# EAGLE schematic matrix (EAGLE 8.4.0)
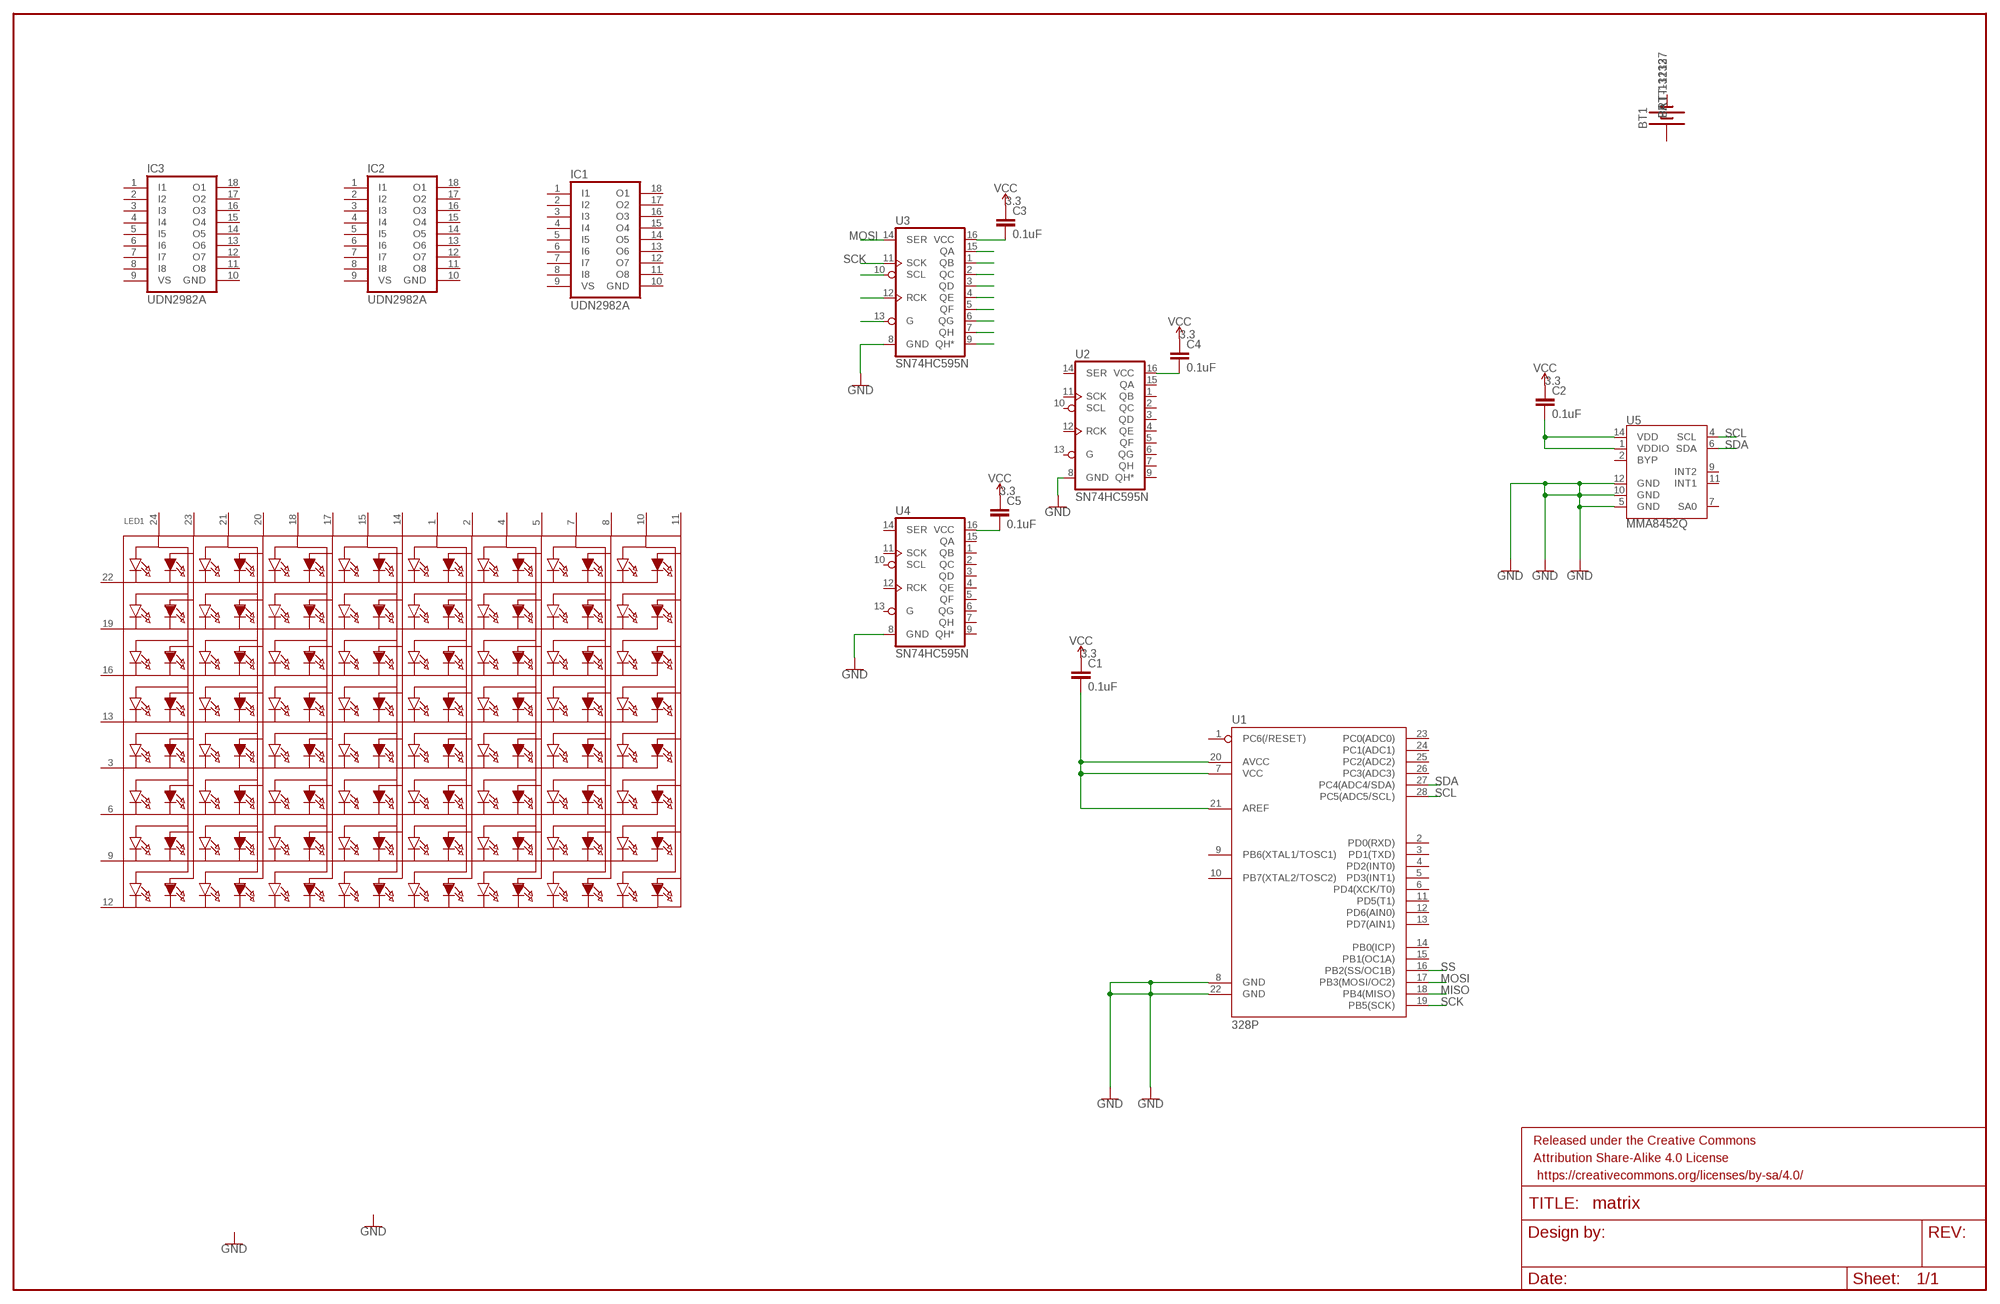
[diagram p0: schematic, sheet 1]

## Parts
BT1  BATTERY-18650  [BATTERY_18650-HOLDER]
C1  0.1uF  0.1UF-0402-16V-10%  [0402]
C2  0.1uF  0.1UF-0402-16V-10%  [0402]
C3  0.1uF  0.1UF-0402-16V-10%  [0402]
C4  0.1uF  0.1UF-0402-16V-10%  [0402]
C5  0.1uF  0.1UF-0402-16V-10%  [0402]
FRAME1  FRAME-LEDGER  [CREATIVE_COMMONS]
IC1  UDN2982A  [DIL18]
IC2  UDN2982A  [DIL18]
IC3  UDN2982A  [DIL18]
LED1  SEGMENT_8X8_BICOLOR_ROWCATHODEMI2A883XX  [SEGMENT_BICOL_BL-M12A883XX]
U1  328P  ATMEGA328P_PDIP  [DIP28]
U2  SN74HC595N  74HC595N  [DIP16]
U3  SN74HC595N  74HC595N  [DIP16]
U4  SN74HC595N  74HC595N  [DIP16]
U5  MMA8452Q  [QFN-16]

## Nets
GND: U1.8(GND) U1.22(GND) U2.8(GND) U3.8(GND) U4.8(GND) U5.5(GND) U5.10(GND) U5.12(GND)
MISO: U1.18(PB4(MISO))
MOSI: U1.17(PB3(MOSI/OC2)) U3.14(SER)
N$1: C2.2 U5.1(VDDIO) U5.14(VDD)
N$2: C1.2 U1.7(VCC) U1.20(AVCC) U1.21(AREF)
N$3: C3.2 U3.16(VCC)
N$5: U3.9(QH*)
N$6: C4.2 U2.16(VCC)
N$7: C5.2 U4.16(VCC)
SCK: U1.19(PB5(SCK))
SCL: U1.28(PC5(ADC5/SCL)) U5.4(SCL)
SDA: U1.27(PC4(ADC4/SDA)) U5.6(SDA)
SS: U1.16(PB2(SS/OC1B))
VCC: C1.1 C2.1 C3.1 C4.1 C5.1
Unconnected: IC1.1(I1) IC1.2(I2) IC1.3(I3) IC1.4(I4) IC1.5(I5) IC1.6(I6) IC1.7(I7) IC1.8(I8) IC1.9(VS) IC1.11(O8) IC1.12(O7) IC1.13(O6) IC1.14(O5) IC1.15(O4) IC1.16(O3) IC1.17(O2) IC1.18(O1) IC2.1(I1) IC2.2(I2) IC2.3(I3) IC2.4(I4) IC2.5(I5) IC2.6(I6) IC2.7(I7) IC2.8(I8) IC2.9(VS) IC2.11(O8) IC2.12(O7) IC2.13(O6) IC2.14(O5) IC2.15(O4) IC2.16(O3) IC2.17(O2) IC2.18(O1) IC3.1(I1) IC3.2(I2) IC3.3(I3) IC3.4(I4) IC3.5(I5) IC3.6(I6) IC3.7(I7) IC3.8(I8) IC3.9(VS) IC3.11(O8) IC3.12(O7) IC3.13(O6) IC3.14(O5) IC3.15(O4) IC3.16(O3) IC3.17(O2) IC3.18(O1) LED1.1(A9) LED1.2(A10) LED1.3(K5) LED1.4(A11) LED1.5(A12) LED1.6(K6) LED1.7(A13) LED1.8(A14) LED1.9(K7) LED1.10(A15) LED1.11(A16) LED1.12(K8) LED1.13(K4) LED1.14(A8) LED1.15(A7) LED1.16(K3) LED1.17(A6) LED1.18(A5) LED1.19(K2) LED1.20(A4) LED1.21(A3) LED1.22(K1) LED1.23(A2) LED1.24(A1) U1.1(PC6(/RESET)) U1.2(PD0(RXD)) U1.3(PD1(TXD)) U1.4(PD2(INT0)) U1.5(PD3(INT1)) U1.6(PD4(XCK/T0)) U1.9(PB6(XTAL1/TOSC1)) U1.10(PB7(XTAL2/TOSC2)) U1.11(PD5(T1)) U1.12(PD6(AIN0)) U1.13(PD7(AIN1)) U1.14(PB0(ICP)) U1.15(PB1(OC1A)) U1.23(PC0(ADC0)) U1.24(PC1(ADC1)) U1.25(PC2(ADC2)) U1.26(PC3(ADC3)) U2.1(QB) U2.2(QC) U2.3(QD) U2.4(QE) U2.5(QF) U2.6(QG) U2.7(QH) U2.9(QH*) U2.10(SCL) U2.11(SCK) U2.12(RCK) U2.13(G) U2.14(SER) U2.15(QA) U3.1(QB) U3.2(QC) U3.3(QD) U3.4(QE) U3.5(QF) U3.6(QG) U3.7(QH) U3.10(SCL) U3.11(SCK) U3.12(RCK) U3.13(G) U3.15(QA) U4.1(QB) U4.2(QC) U4.3(QD) U4.4(QE) U4.5(QF) U4.6(QG) U4.7(QH) U4.9(QH*) U4.10(SCL) U4.11(SCK) U4.12(RCK) U4.13(G) U4.14(SER) U4.15(QA) U5.2(BYP) U5.7(SA0) U5.9(INT2) U5.11(INT1)

## Power pins joined to a net without a drawn wire
+: BT1.PWR@1(+)
-: BT1.GND@1(-)
GND: IC1.10(GND) IC2.10(GND) IC3.10(GND)

## Library data of the parts
BT1 = SparkFun-Batteries:BATTERY: Battery - Single Cell A variety of battery chemistries, sizes, and footprints. Device List: 20MM_PTH - Coin Cell Battery Holder - 20mm (PTH) <https://www.sparkfun.com/products/783> 6.8MM_PTH - Coin Cell Battery Holder - 6.8MM(SMD) <https://www.digikey.com/product-detail/en/seiko-instruments/MS621FE-FL11E/728-1057-ND/1889208?WT.srch=1&gclid=CNOQ5a6LzdQCFZS2wAodXCkE0g> 12MM_SMD - Coin Cell Battery Holder - 12mm (SMD) <https://www.sparkfun.com/products/10592> 12MM_PTH - Coin Cell Battery Holder - 12mm (PTH) <https://www.sparkfun.com/products/7948> 20MM_SMD - 20mm Coin Cell Battery Holder (SMD) (2 legs) Used on the Big Time Watch Kit <https://www.sparkfun.com/products/11734> 20MM_SMD_4LEGS - Coin Cell Battery Holder - 20mm (SMD) <https://www.sparkfun.com/products/11892> 20MM_SMD_4LEGS_OVERPASTE - Coin Cell Battery Holder - 20mm (SMD) <https://www.sparkfun.com/products/11892> (Over-paste on the legs) 24.5MM_PTH - Coin Cell Battery Holder - 24.5mm (PTH) <https://www.sparkfun.com/products/8863> 9V - 9V Battery Holder - PC Mount Used on the SparkFun SparkPunk Sound Kit <https://www.sparkfun.com/products/11177> and SparkFun SparkPunk Sequencer Kit <https://www.sparkfun.com/products/12707> 18650 - Battery Holder - 18650 (PTH) <https://www.sparkfun.com/products/13113> AA - Battery Holder - 1xAA (PTH) <https://www.sparkfun.com/products/7949> AAA - Battery Holder - 1xAAA (PTH) <https://www.sparkfun.com/products/12718> AA_KIT - Battery Holder - 1xAA (PTH) <https://www.sparkfun.com/products/7949> Special kit package - pads only have exposed copper on one side of the board. AAA_KIT - Battery Holder - 1xAAA (PTH) <https://www.sparkfun.com/products/12718> Special kit package - pads only have exposed copper on one side of the board.; PROD_ID: BATT-12327; SF_SKU: PRT-13113
C1-C5 = SparkFun-Capacitors:0.1UF: 0.1µF ceramic capacitors A capacitor is a passive two-terminal electrical component used to store electrical energy temporarily in an electric field.; PROD_ID: CAP-12416
FRAME1 = SparkFun-Aesthetics:FRAME-LEDGER: Schematic Frame - Ledger Standard 11x14 US Ledger frame
IC1-IC3 = uln-udn:UDN298*: DRIVER ARRAY Source: Allegro Microsystems Inc. / UDN2981-UDN2984.pdf
LED1 = adafruit:SEGMENT_8X8_BICOLOR_ROWCATHODE: 8x8 Bi-Color LED Segment Displays: Row = Cathode 1.2" Bi-Color 8x8 Matrix, 3.0mm Square LEDs - BL-M12A883XX
U1 = SparkFun-IC-Microcontroller:ATMEGA328P_PDIP: Atmel 328P Through hole ATMEGA328P uC used in the Arduino 32kb flash, 1k EEPROM, 2k SRAM Datasheet <http://www.sparkfun.com/datasheets/Components/SMD/ATMega328.pdf> SparkFun Products Storefront component: AVR 28 Pin 20MHz 32K 6A/D - ATMega328P <https://www.sparkfun.com/products/9061> (COM-09061) SparkFun Simon Says - Through-Hole Soldering Kit <https://www.sparkfun.com/products/10547> (KIT-10547) SparkFun Learn to Solder - Simon Says <https://www.sparkfun.com/products/13708> (KIT-13708) SparkFun BigTime Watch Kit <https://www.sparkfun.com/products/11734> (KIT-11734) SparkFun ClockIt <https://www.sparkfun.com/products/10930> (KIT-10930) SparkFun Serial Enabled LCD Kit <https://www.sparkfun.com/products/10097> (LCD-10097) SparkFun Simon Tilts - Through Hole Soldering Kit <https://www.sparkfun.com/products/12634> (KIT-12634) SparkFun Frequency Counter Kit <https://www.sparkfun.com/products/10140> (KIT-10140) FabFM Radio Kit <https://www.sparkfun.com/products/11043> (KIT-11043) SparkFun Binary Blaster Kit <https://www.sparkfun.com/products/12037> (KIT-12037) SparkFun Metro-Gnome <https://www.sparkfun.com/products/9236> (KIT-09236) ATmega328 with Arduino Optiboot (Uno) <https://www.sparkfun.com/products/10524> (DEV-10524); PROD_ID: IC-09136
U2-U4 = SparkFun-IC-Logic:74*595: 8-Bit Shift Register (Serial to Parallel) Datasheet <http://cdn.sparkfun.com/datasheets/BreakoutBoards/MM74HC595.pdf> SparkFun Products SparkFun Shift Register Breakout - 74HC595 <https://www.sparkfun.com/products/10680> (BOB-10680); PROD_ID: IC-13123
U5 = SparkFun-Sensors:MMA8452Q: NXP MMA8452Q 3-Axis Digital Accelerometer The MMA8452Q is a smart low-power, three-axis, capacitive MEMS accelerometer with 12 bits of resolution. This accelerometer is packed with embedded functions with flexible user programmable options, configurable to two interrupt pins. Supply Voltage: 1.6-3.6V Range: +/- 2g, 4g, 8g Interface: I2C, 12-bit and 8-bit ODR: 1.56 Hz - 800 Hz Package: QFN-16 Datasheet <http://cache.freescale.com/files/sensors/doc/data_sheet/MMA8452Q.pdf> SparkFun Products SparkFun Triple Axis Accelerometer Breakout - MMA8452Q <https://www.sparkfun.com/products/12756> (SEN-12756) SparkFun RedBot Sensor - Accelerometer <https://www.sparkfun.com/products/12589> (SEN-12589); PROD_ID: IC-10769